# EAGLE design JF-SV-LP0001 (EAGLE 7.7.0)
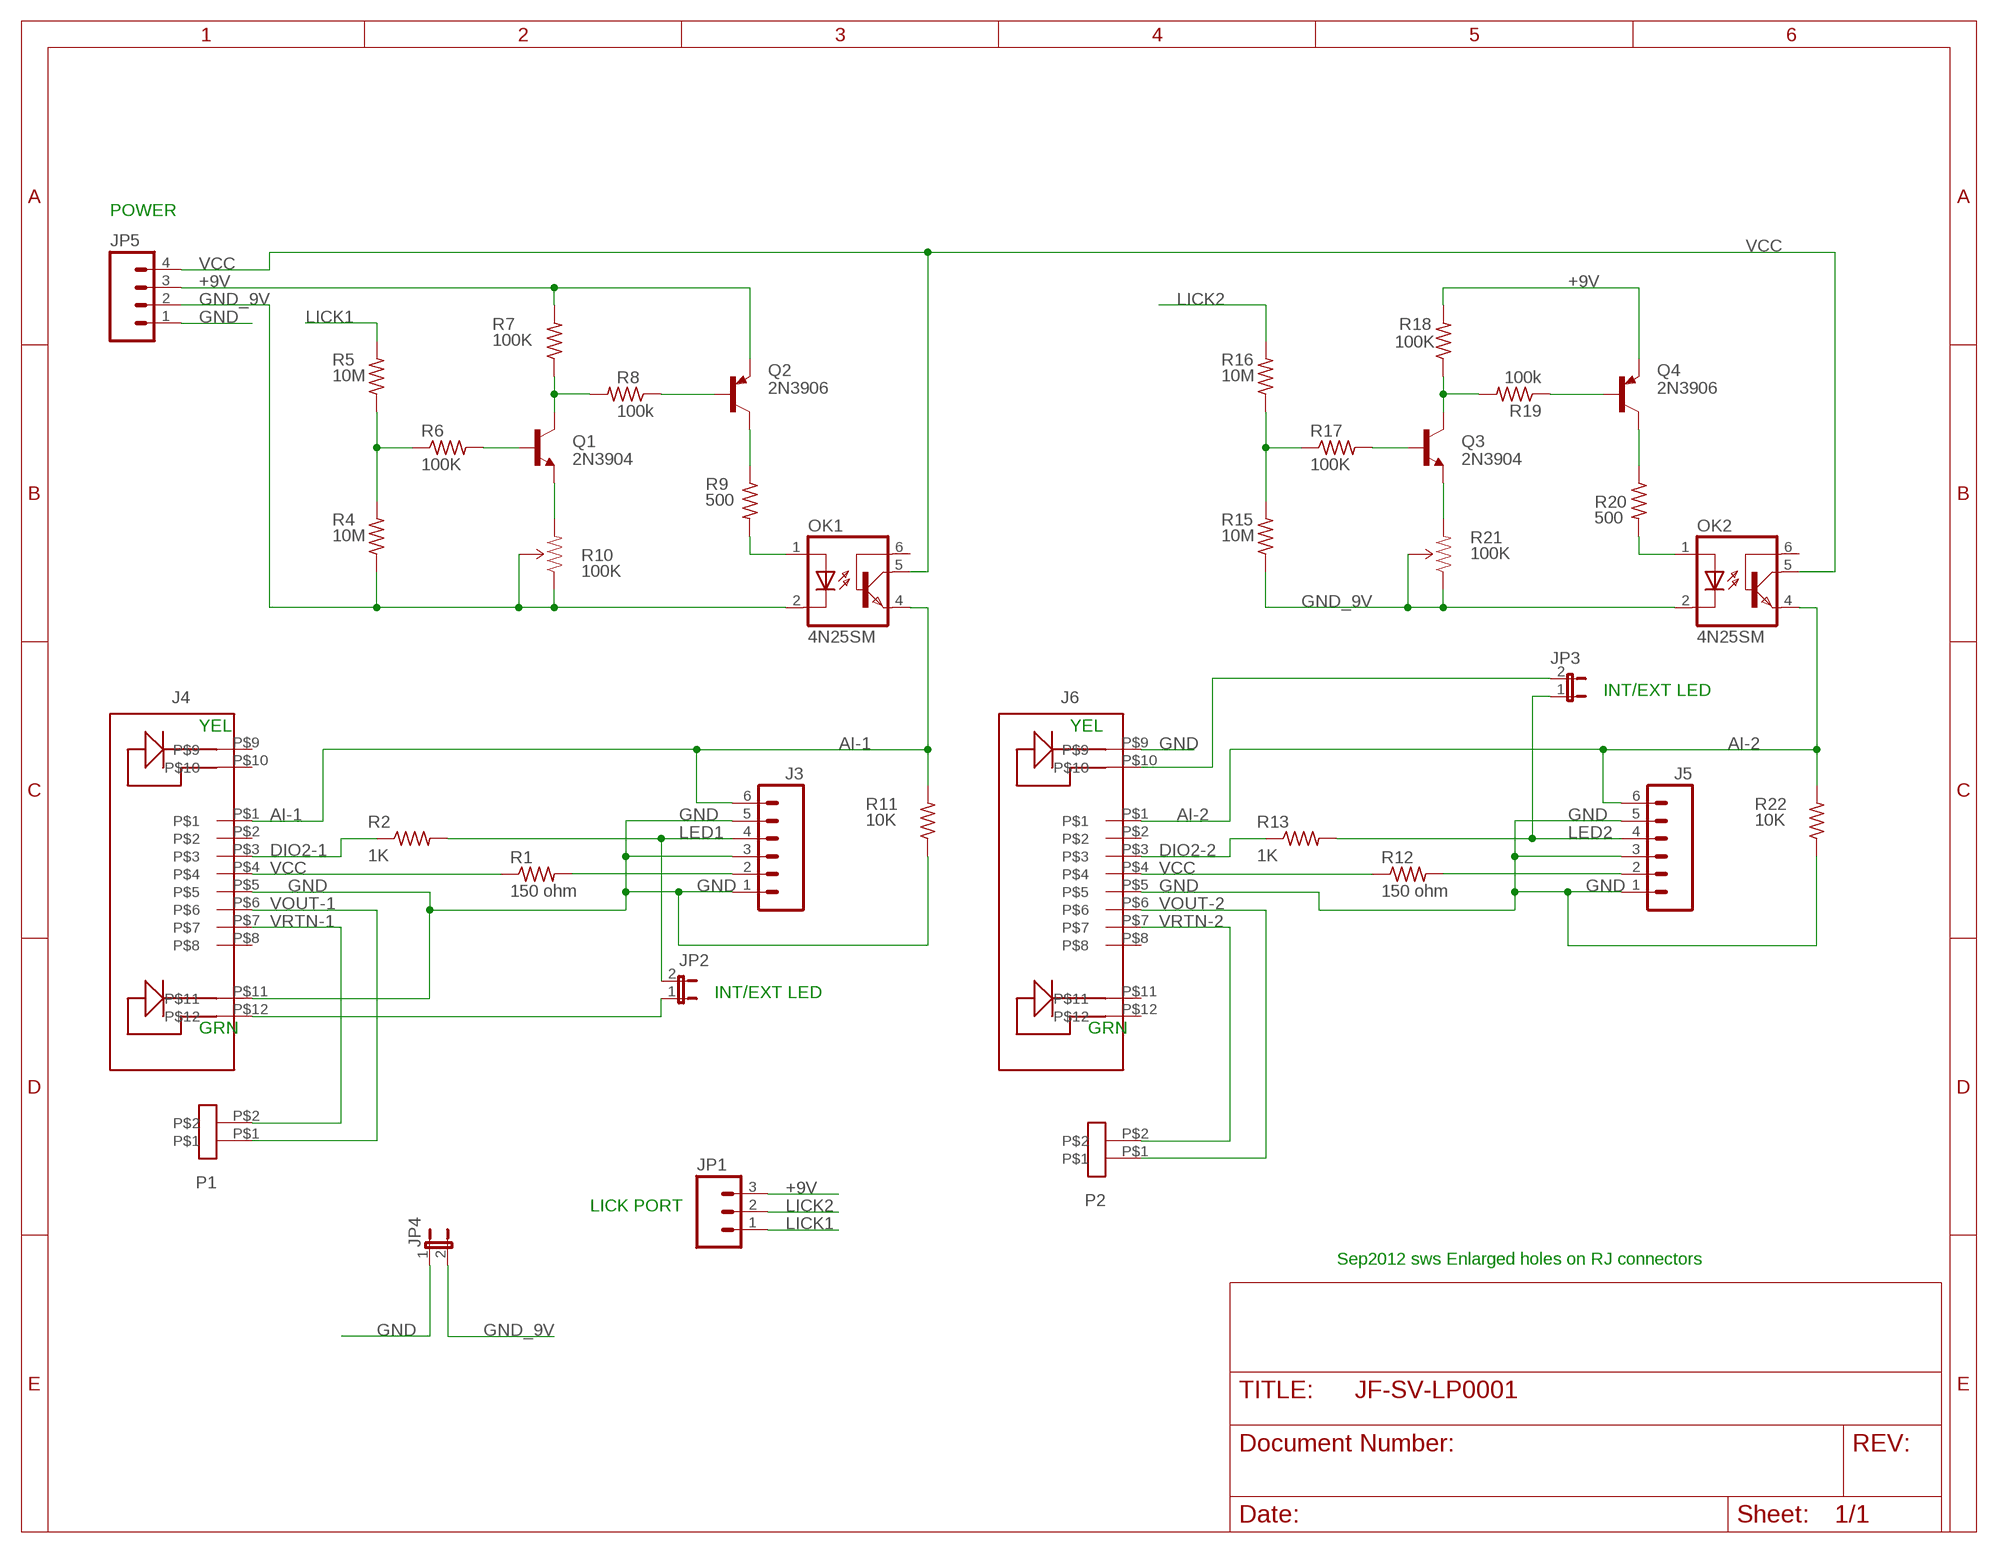
[diagram p0: schematic, sheet 1]

## Parts
J3  M063.5MM-6  [SCREWTERMINAL-3.5MM-6]
J4  RJ45_LED  [RJ45_LED]
J5  M063.5MM-6  [SCREWTERMINAL-3.5MM-6]
J6  RJ45_LED  [RJ45_LED]
JP1  M03POLAR  [MOLEX-1X3]
JP2  JP1E  [JP1]
JP3  JP1E  [JP1]
JP4  JUMPER-2PTH  [1X02]
JP5  M04POLAR  [MOLEX-1X4]
OK1  4N25SM  [DIL6-SMD]
OK2  4N25SM  [DIL6-SMD]
P1  CON2MICRO-FIT  [MICRO-FIT-2-RA]
P2  CON2MICRO-FIT  [MICRO-FIT-2-RA]
Q1  2N3904  MMBT3904LT1-NPN-SOT23-BEC  [SOT23-BEC]
Q2  2N3906  MMBT3906LT1-PNP-SOT23-BEC  [SOT23-BEC]
Q3  2N3904  MMBT3904LT1-NPN-SOT23-BEC  [SOT23-BEC]
Q4  2N3906  MMBT3906LT1-PNP-SOT23-BEC  [SOT23-BEC]
R1  150 ohm  RESISTOR_SM0805S  [0805S]
R2  1K  RESISTOR_SM0805S  [0805S]
R4  10M  RESISTOR_SM0805S  [0805S]
R5  10M  RESISTOR_SM0805S  [0805S]
R6  100K  RESISTOR_SM0805S  [0805S]
R7  100K  RESISTOR_SM0805S  [0805S]
R8  100k  RESISTOR_SM0805S  [0805S]
R9  500  RESISTOR_SM0805S  [0805S]
R10  100K  TRIMPOTPTH  [TRIM_POT_PTH]
R11  10K  RESISTOR_SM0805S  [0805S]
R12  150 ohm  RESISTOR_SM0805S  [0805S]
R13  1K  RESISTOR_SM0805S  [0805S]
R15  10M  RESISTOR_SM0805S  [0805S]
R16  10M  RESISTOR_SM0805S  [0805S]
R17  100K  RESISTOR_SM0805S  [0805S]
R18  100K  RESISTOR_SM0805S  [0805S]
R19  100k  RESISTOR_SM0805S  [0805S]
R20  500  RESISTOR_SM0805S  [0805S]
R21  100K  TRIMPOTPTH  [TRIM_POT_PTH]
R22  10K  RESISTOR_SM0805S  [0805S]

## Nets
+9V: JP1.3 JP5.3 Q2.E Q4.E R7.2 R18.2
AI-1: J3.6 J4.P$1 OK1.4(EMI) R11.2
AI-2: J5.6 J6.P$1 OK2.4(EMI) R22.2
DIO2-1: J4.P$3 R2.1
DIO2-2: J6.P$3 R13.1
GND: J3.1 J3.3 J3.5 J4.P$5 J4.P$11 J5.1 J5.3 J5.5 J6.P$5 J6.P$9 JP4.1 JP5.1 R11.1 R22.1
GND_9V: JP4.2 JP5.2 OK1.2(C) OK2.2(C) R4.1 R10.1(CCW) R10.2(WIPER) R15.1 R21.1(CCW) R21.2(WIPER)
LED1: J3.4 JP2.2 R2.2
LED2: J5.4 JP3.1 R13.2
LICK1: JP1.1 R5.2
LICK2: JP1.2 R16.2
N$1: J3.2 R1.2
N$3: OK1.1(A) R9.2
N$8: J4.P$12 JP2.1
N$12: R4.2 R5.1 R6.1
N$13: Q1.B R6.2
N$14: Q1.E R10.3(CW)
N$15: Q1.C R7.1 R8.2
N$16: Q2.B R8.1
N$18: Q2.C R9.1
N$19: J6.P$10 JP3.2
N$21: J5.2 R12.2
N$23: R15.2 R16.1 R17.1
N$24: Q3.B R17.2
N$25: Q3.E R21.3(CW)
N$26: Q3.C R18.1 R19.2
N$27: Q4.B R19.1
N$32: OK2.1(A) R20.2
N$33: Q4.C R20.1
VCC: J4.P$4 J6.P$4 JP5.4 OK1.5(COL) OK2.5(COL) R1.1 R12.1
VOUT-1: J4.P$6 P1.P$1
VOUT-2: J6.P$6 P2.P$1
VRTN-1: J4.P$7 P1.P$2
VRTN-2: J6.P$7 P2.P$2
Unconnected: J4.P$2 J4.P$8 J4.P$9 J4.P$10 J6.P$2 J6.P$8 J6.P$11 J6.P$12 OK1.6(BAS) OK2.6(BAS)

## Notes on the sheet
- POWER
- INT/EXT LED
- YEL | YEL
- INT/EXT LED
- GRN | GRN
- LICK PORT
- Sep2012 sws Enlarged holes on RJ connectors

## Library data of the parts
J3 J5 = SparkFun:M06: Header 6 Standard 6-pin 0.1" header. Use with straight break away headers (SKU : PRT-00116), right angle break away headers (PRT-00553), swiss pins (PRT-00743), machine pins (PRT-00117), and female headers (PRT-00115). Molex polarized connector foot print use with SKU : PRT-08094 with associated crimp pins and housings. NOTES ON THE VARIANTS LOCK and LOCK_LONGPADS... This footprint was designed to help hold the alignment of a through-hole component (i.e. 6-pin header) while soldering it into place. You may notice that each hole has been shifted either up or down by 0.005 of an inch from it's more standard position (which is a perfectly straight line). This slight alteration caused the pins (the squares in the middle) to touch the edges of the holes. Because they are alternating, it causes a "brace" to hold the component in place. 0.005 has proven to be the perfect amount of "off-center" position when using our standard breakaway headers. Although looks a little odd when you look at the bare footprint, once you have a header in there, the alteration is very hard to notice. Also, if you push a header all the way into place, it is covered up entirely on the bottom side. This idea of altering the position of holes to aid alignment will be further integrated into the Sparkfun Library for other footprints. It can help hold any component with 3 or more connection pins.
J4 J6 = SteveS:RJ45_LED
JP1 = SparkFun:M03: Header 3 Standard 3-pin 0.1" header. Use with straight break away headers (SKU : PRT-00116), right angle break away headers (PRT-00553), swiss pins (PRT-00743), machine pins (PRT-00117), and female headers (PRT-00115). Molex polarized connector foot print use with SKU : PRT-08232 with associated crimp pins and housings.
JP2 JP3 = jumper:JP1E: JUMPER
JP4 = SparkFun:JUMPER-2: Jumper Basic 0.1" spaced jumper. Use with breakaway headers.
JP5 = SparkFun:M04: Header 4 Standard 4-pin 0.1" header. Use with straight break away headers (SKU : PRT-00116), right angle break away headers (PRT-00553), swiss pins (PRT-00743), machine pins (PRT-00117), and female headers (PRT-00115). Molex polarized connector foot print use with SKU : PRT-08231 with associated crimp pins and housings.
OK1 OK2 = optocoupler:4N*?M: General Purpose 6-Pin Phototransistor Optocouplers Source: http://www.fairchildsemi.com/ds/4N/4N35-M.pdf; MF: FAIRCHILD SEMICONDUCTOR; MPN: 4N25SM; OC_FARNELL: 1021152; OC_NEWARK: 34C2020
P1 P2 = SteveS:CON2
Q1 Q3 = transistor-neu-to92:*-NPN-: NPN Transistror
Q2 Q4 = transistor:*-PNP-: PNP Transistror
R1 R2 R4-R9 R11-R13 R15-R20 R22 = SteveS:RESISTOR_SM
R10 R21 = SparkFun:TRIMPOT

## Board
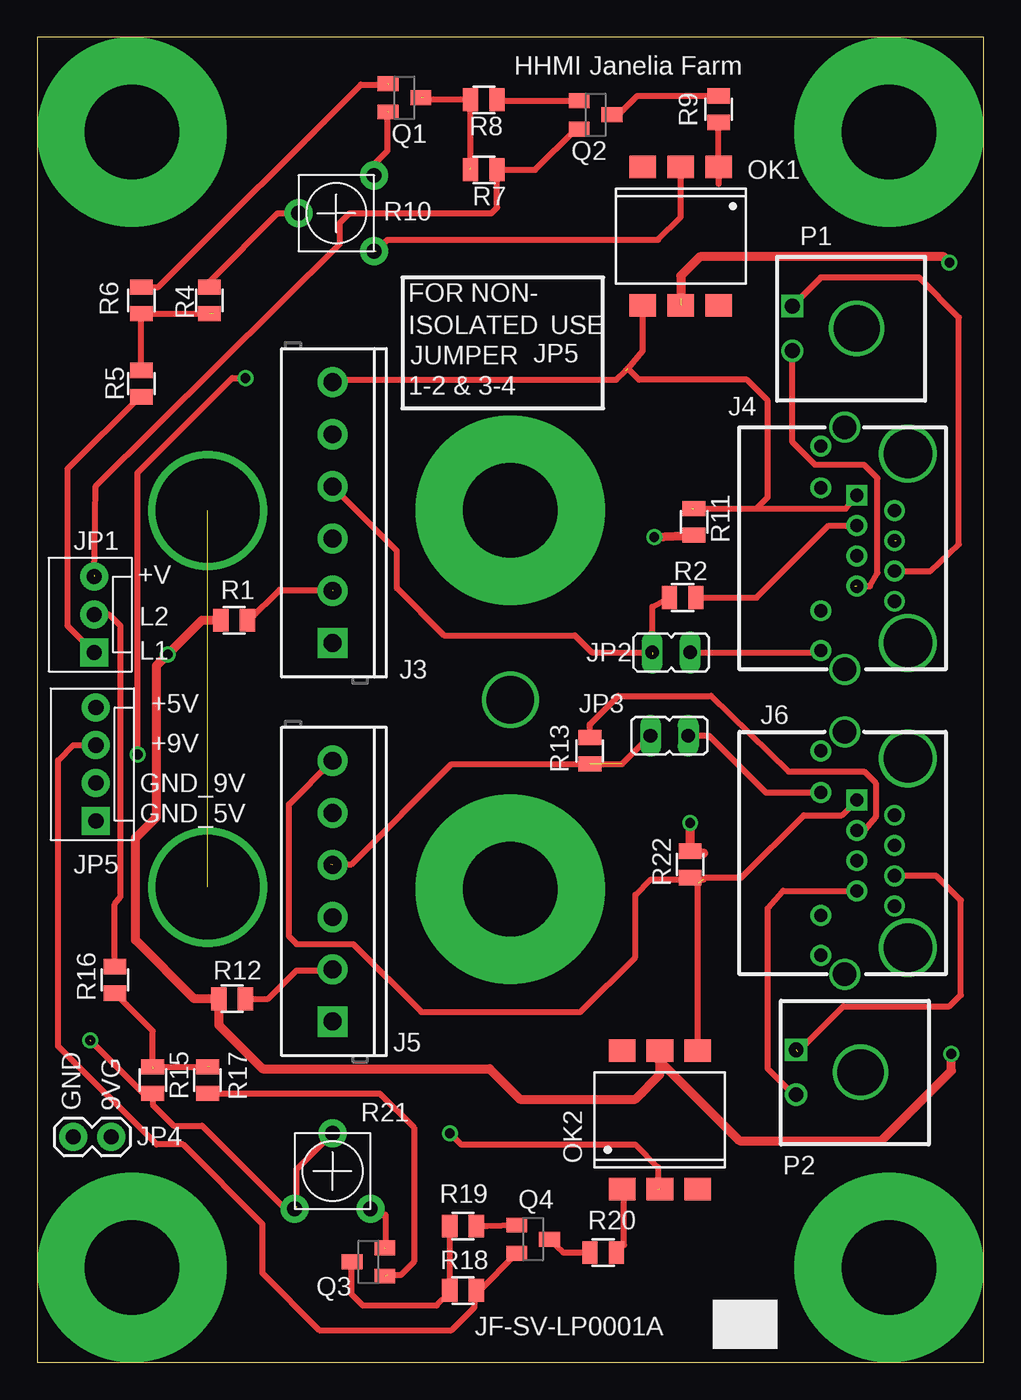
[diagram p1: board, top side]
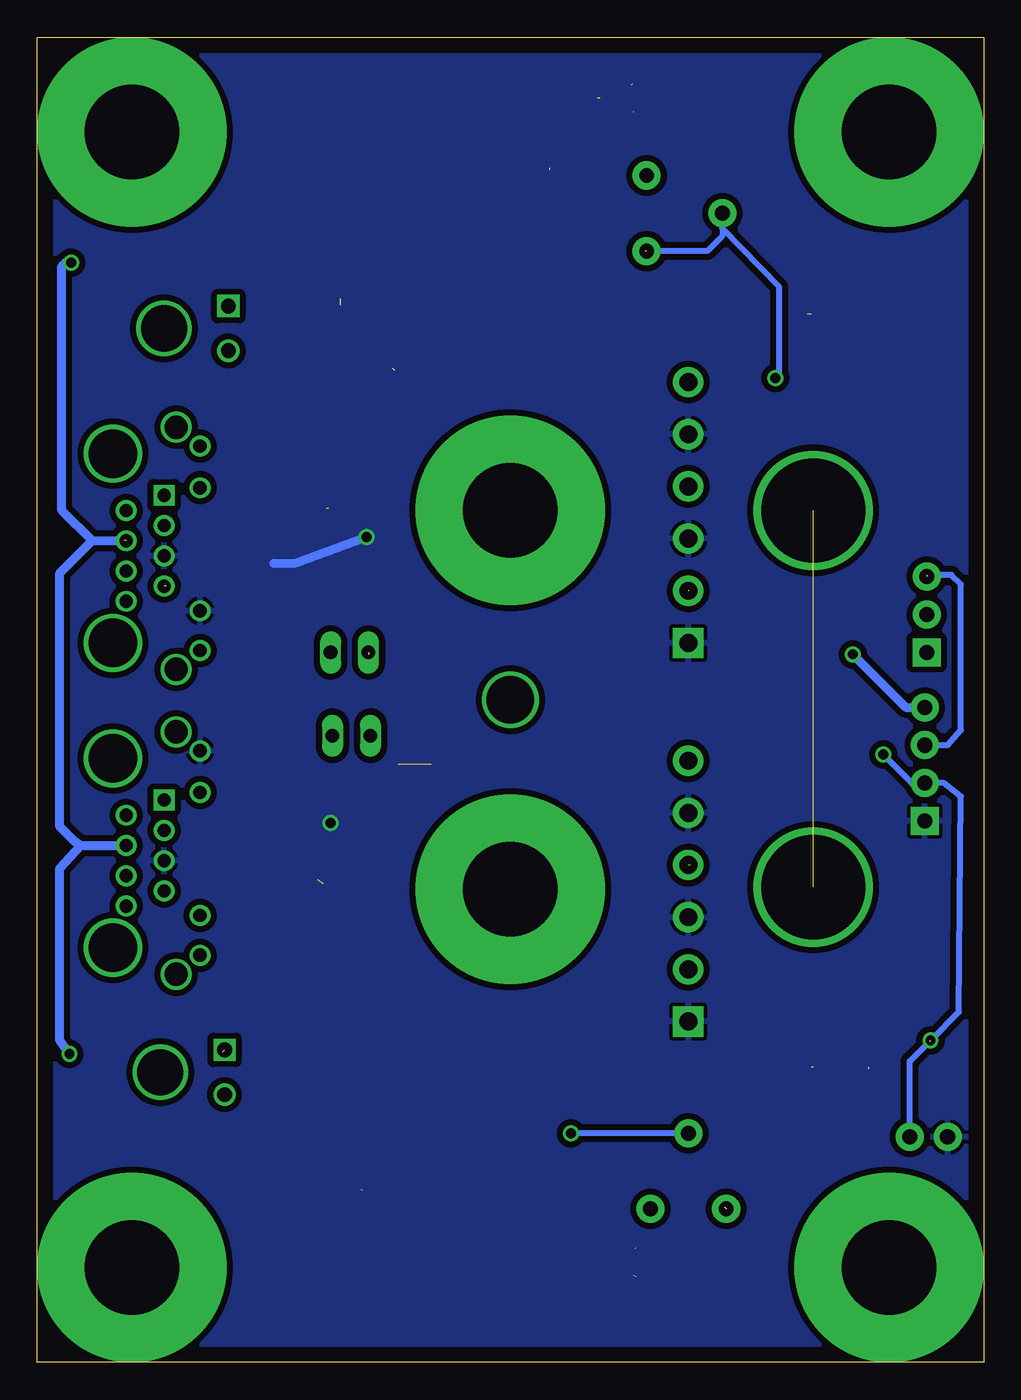
[diagram p2: board, bottom side, seen from below]

Size 63.5 x 88.9 mm. Coordinates in mm from the lower left corner, seen from the top.
Outline: 63.5,0 63.5,88.9 0,88.9 0,0 63.5,0
Copper layers (1*16): Top 0.035mm / dielectric 1.5mm / Bottom 0.035mm
Design rules "default": minimum track width 10mil, minimum drill 24mil, track to track 8mil, track to pad 8mil, pad to pad 8mil, via to via 8mil, smd to smd 8mil, copper to edge 40mil, drill to drill 8mil, minimum pad ring 10mil, minimum via ring 8mil, stop-mask expansion 4mil, vias tented up to drill 0mil, thermal gap 10mil

### Footprints (pad centres in the part's own frame; a part is rotated, then mirrored left to right if it is on the bottom)
SCREWTERMINAL-3.5MM-6 = drill 1.2 pad 2.032 square: 1 0,0 | drill 1.2 pad 2.032: 2 3.5,0; 3 7,0; 4 10.5,0; 5 14,0; 6 17.5,0
RJ45_LED = drill 3.251 pad 3.251: A -6.35,0; B 6.35,0 | drill 0.889 square: P$1 3.556,3.429 | drill 0.889: P$2 2.54,0.889; P$3 1.524,3.429; P$4 0.508,0.889; P$5 -0.508,3.429; P$6 -1.524,0.889; P$7 -2.54,3.429; P$8 -3.556,0.889; P$9 6.858,5.842; P$10 4.064,5.842; P$11 -4.191,5.842; P$12 -6.858,5.842 | drill 1.575 pad 2.083: P$13 8.128,4.242; P$14 -8.128,4.242
MOLEX-1X3 = drill 1.016 pad 1.88 square: 1 0,0 | drill 1.016 pad 1.88: 2 2.54,0; 3 5.08,0
JP1 = drill 0.914 long: 1 0,-1.27; 2 0,1.27
1X02 = drill 1.016 pad 1.88: 1 0,0; 2 2.54,0
MOLEX-1X4 = drill 1.016 pad 1.88 square: 1 0,0 | drill 1.016 pad 1.88: 2 2.54,0; 3 5.08,0; 4 7.62,0
DIL6-SMD = smd 1.78 x 1.52: 1 -2.54,-4.645; 2 0,-4.645; 3 2.54,-4.645; 4 2.54,4.645; 5 0,4.645; 6 -2.54,4.645
MICRO-FIT-2-RA = drill 3.099: A 1.499,4.318 | drill 0.991 square: P$1 0,0 | drill 0.991: P$2 2.997,0
SOT23-BEC = smd 1 x 1.4: B -0.95,-1.1; C 0,1.1; E 0.95,-1.1
0805S = smd 1.016 x 1.524: 1 -0.889,0; 2 0.889,0
TRIM_POT_PTH = drill 1 pad 1.88: 1 -2.54,-2.54; 2 0,2.54; 3 2.54,-2.54

### Placement (x,y rotation side)
J3  19.81,48.26 90 top
J4  58.42,54.61 90 top
J5  19.81,22.86 90 top
J6  58.42,34.16 90 top
JP1  3.81,47.62 90 top
JP2  42.55,47.62 90 top
JP3  42.42,42.04 270 top
JP4  2.41,15.11 0 top
JP5  3.94,36.32 90 top
OK1  43.18,75.56 180 top
OK2  41.78,16.26 0 top
P1  50.67,70.87 270 top
P2  50.93,20.95 270 top
Q1  24.64,84.84 270 top
Q2  37.47,83.69 270 top
Q3  22.23,6.73 90 top
Q4  33.27,8.26 270 top
R1  13.21,49.78 0 top
R2  43.31,51.31 180 top
R4  11.56,71.25 270 top
R5  6.99,65.66 270 top
R6  6.99,71.25 90 top
R7  29.97,80.01 0 top
R8  29.97,84.71 180 top
R9  45.72,84.07 270 top
R10  20.07,77.09 90 top
R11  44.07,56.39 90 top
R12  13.08,24.38 0 top
R13  37.08,41.02 270 top
R15  7.75,18.92 90 top
R16  5.21,25.65 90 top
R17  11.43,18.92 270 top
R18  28.57,4.83 0 top
R19  28.57,9.14 180 top
R20  37.97,7.37 0 top
R21  19.81,12.83 0 top
R22  43.81,33.4 270 top

### Tracks (layer width: path | path; a pad name or v marks a point on that pad's centre or on a via)
+9V  (1 unrouted)
  Top 0.406: Q2.E 36.13,82.74 33.4,80.01 R7.2 30.86,77.47 30.48,77.09 20.95,77.09 20.32,76.45 20.32,75.06 3.94,58.8 JP1.3 | Q4.E 29.65,4.76 R18.2 29.34,3.81 29.34,3.68 27.81,2.16 18.92,2.16 15.11,5.97 15.11,9.27 9.78,14.61 8,14.61 1.4,21.21 1.4,40.39 2.41,41.4 JP5.3
  Bottom 0.406: JP5.3 2.41,41.4 1.52,42.42 1.52,52.2 2.16,52.83 3.81,52.83
AI-1  (2 unrouted)
  Top 0.406: J4.P$1 54.23,57.28 48.26,57.28 | J3.6 19.96,65.91 38.86,65.91 39.5,66.55 | OK1.4 40.64,67.87 39.62,66.67 40.39,65.91 47.62,65.91 49.02,64.52 49.02,58.04 48.26,57.28 | 43.94,57.28 48.26,57.28
AI-2  (1 unrouted)
  Top 0.406: J5.6 16.89,37.44 16.89,28.57 17.4,28.07 21.21,28.07 25.78,23.5 36.45,23.5 40.13,27.18 40.13,31.37 41.15,32.38 44.7,32.38 44.83,32.51 47.24,32.51 51.44,36.7 53.98,36.7 J6.P$1 | OK2.4 44.32,32.13 R22.2
DIO2-1
  Top 0.406: J4.P$3 53.09,56.13 48.26,51.31 R2.1
DIO2-2
  Top 0.406: R13.1 37.08,42.8 38.99,44.7 45.21,44.7 50.42,39.62 55.5,39.62 56.26,38.86 56.26,36.58 55.5,35.69 J6.P$3
GND  (via drill 0.66)
  Top 0.61: 44.2,55.37 R11.1 v41.4,55.37 | 44.7,34.16 R22.1 v43.81,36.2
  Bottom 0.61: v41.4,55.37 46.23,53.59 47.62,53.59
  pour Bottom (isolate 0.406): 0.89,88.01 0.89,0.64 62.61,0.64 62.61,88.01
GND_9V  (via drill 0.66)  (4 unrouted)
  Top 0.406: R21.1 16.64,10.29 11.05,15.88 9.14,15.88 7.75,17.27 R15.1 7.11,18.03 v3.56,21.59 | R21.2 17.4,12.95 17.4,10.41 | v27.69,15.37 28.45,14.61 40.13,14.61 41.66,13.08 41.66,11.56 | OK1.2 43.18,76.83 41.66,75.31 23.5,75.31 22.73,74.55 | R4.1 11.56,72.52 16.13,77.09 R10.2 | v6.73,40.77 6.73,59.69 13.08,66.04 v13.97,66.04
  Bottom 0.406: v3.56,21.59 1.65,23.5 1.52,37.97 2.67,38.86 JP5.2 4.83,38.86 v6.73,40.77 | R21.2 v27.69,15.37 | R10.1 18.54,74.55 17.53,75.56 17.53,76.07 | v13.97,66.04 13.72,66.29 13.72,72.14 17.53,76.07 | 17.53,76.07 R10.2 | JP4.2 4.95,20.19 3.62,21.53
LED1  (1 unrouted)
  Top 0.406: J3.4 24.13,54.44 24.13,51.94 27.3,48.77 36.07,48.77 37.21,47.62 JP2.2 | R2.2 41.27,50.67 41.27,47.5
LED2  (2 unrouted)
  Top 0.406: JP3.1 39.24,40.13 27.81,40.13 21.08,33.4 19.68,33.4
LICK1
  Top 0.406: JP1.1 2.03,49.4 2.03,59.94 6.86,64.77 R5.2
LICK2
  Top 0.406: R16.2 5.21,30.73 5.59,31.24 5.59,49.4 4.83,50.16 JP1.2
N$1  (1 unrouted)
  Top 0.406: R1.2 14.22,49.78 16.26,51.82 19.81,51.82 19.94,51.69
N$3
  Top 0.406: R9.2 OK1.1 45.72,79.07
N$4  (via drill 3.17)
  other vias: 31.75,44.45
N$5  (via drill 6.35 pad 12.7)
  other vias: 6.35,6.35
N$6  (via drill 6.35 pad 12.7)
  other vias: 57.15,6.35
N$7  (via drill 6.35 pad 12.7)
  other vias: 57.15,82.55
N$8
  Top 0.406: J4.P$12 51.94,47.62 JP2.1
N$9  (via drill 6.35 pad 12.7)
  other vias: 31.75,57.15
N$10  (via drill 6.35 pad 12.7)
  other vias: 31.75,31.75
N$12  (1 unrouted)
  Top 0.406: R5.1 R6.1 11.81,70.36
N$13  (1 unrouted)
  Top 0.406: R6.2 8.13,72.14 21.72,85.72 23.62,85.72
N$14  (1 unrouted)
  Top 0.406: R10.3 22.61,80.39 23.5,81.28 23.5,83.95
N$15  (2 unrouted)
  Top 0.406: 29.08,80.14 R8.2 26.04,84.71 25.91,84.84
N$16
  Top 0.406: Q2.B 30.93,84.64 R8.1
N$17  (via drill 6.35 pad 12.7)
  other vias: 6.35,82.55
N$18
  Top 0.406: Q2.C 38.99,83.69 40.26,84.96 R9.1 45.85,84.84
N$19
  Top 0.406: JP3.2 45.09,42.04 48.9,38.23 J6.P$10 52.58,38.1
N$21
  Top 0.406: R12.2 15.49,24.38 17.4,26.29 19.74,26.29 J5.2
N$23  (2 unrouted)
  Top 0.406: R16.1 7.75,22.23 7.75,19.68 7.87,19.81 11.56,19.81
N$24  (1 unrouted)
  Top 0.406: R17.2 22.99,18.03 25.27,15.75 25.27,6.73 24.38,5.84 23.5,5.84
N$25  (1 unrouted)
  Top 0.406: R21.3 22.73,9.91 23.37,9.91 23.37,7.62
N$26
  Top 0.406: R19.2 R18.1 27.69,4.7 26.8,3.81 21.84,3.81 21.08,4.57 21.08,6.18 Q3.C
N$27
  Top 0.406: Q4.B 30.2,9.14 R19.1
N$32
  Top 0.406: OK2.1 39.37,11.48 39.37,7.87 R20.2
N$33
  Top 0.406: R20.1 35.31,7.37 Q4.C
NC2  (via drill 6.99)  (1 unrouted)
  other vias: 11.43,57.15 11.43,31.88
VCC  (via drill 0.66)  (2 unrouted)
  Top 0.61: R1.1 11.05,49.78 v8.76,47.5 8,46.74 8,36.58 6.6,35.18 6.6,28.32 10.54,24.38 R12.1 12.19,22.61 15.11,19.68 30.35,19.68 32.38,17.65 40.13,17.65 41.78,19.3 OK2.5 41.66,20.77 41.66,20.32 47.12,14.86 56.64,14.86 61.34,19.56 v61.34,20.7 | v61.21,73.79 60.83,74.17 44.45,74.17 43.18,72.9 43.18,71.37
  Bottom 0.61: v8.76,47.5 5.21,43.94 JP5.4 | v61.34,20.7 61.98,21.59 61.98,33.15 60.58,34.67 | 60.58,34.67 J6.P$4 | 60.58,34.67 60.96,34.92 61.98,35.94 61.98,52.96 59.82,55.12 | 59.82,55.12 57.66,55.12 | 59.82,55.12 61.85,57.15 61.85,73.53 61.59,73.79 v61.21,73.79
VOUT-1
  Top 0.406: P1.P$1 52.58,72.77 59.18,72.77 61.85,70.1 61.85,54.86 59.94,53.09 J4.P$6
VOUT-2  (1 unrouted)
  Top 0.406: J6.P$6 60.33,32.64 61.98,30.99 61.98,24.64 61.21,23.88 54.1,23.88 51.05,20.83
VRTN-1  (1 unrouted)
  Top 0.406: P1.P$2 50.67,61.72 52.2,60.2 55.5,60.2 56.39,59.31 56.39,52.96 55.88,52.07 54.86,52.07
VRTN-2
  Top 0.406: P2.P$2 50.75,17.96 49.02,19.68 49.02,30.48 50.04,31.62 J6.P$7

### Text on the board
tPlace: HHMI Janelia Farm | P1 | FOR | NON- | ISOLATED | USE | JUMPER | JP5 | 1-2 & 3-4 | J4 | JP1 | +V | L2 | L1 | +5V | J6 | +9V | GND_9V | GND_5V | JP5 | GND | 9VG | P2 | JF-SV-LP0001A